# EAGLE design Bond-C3-Mini-VL-ALS (EAGLE 9.6.2)
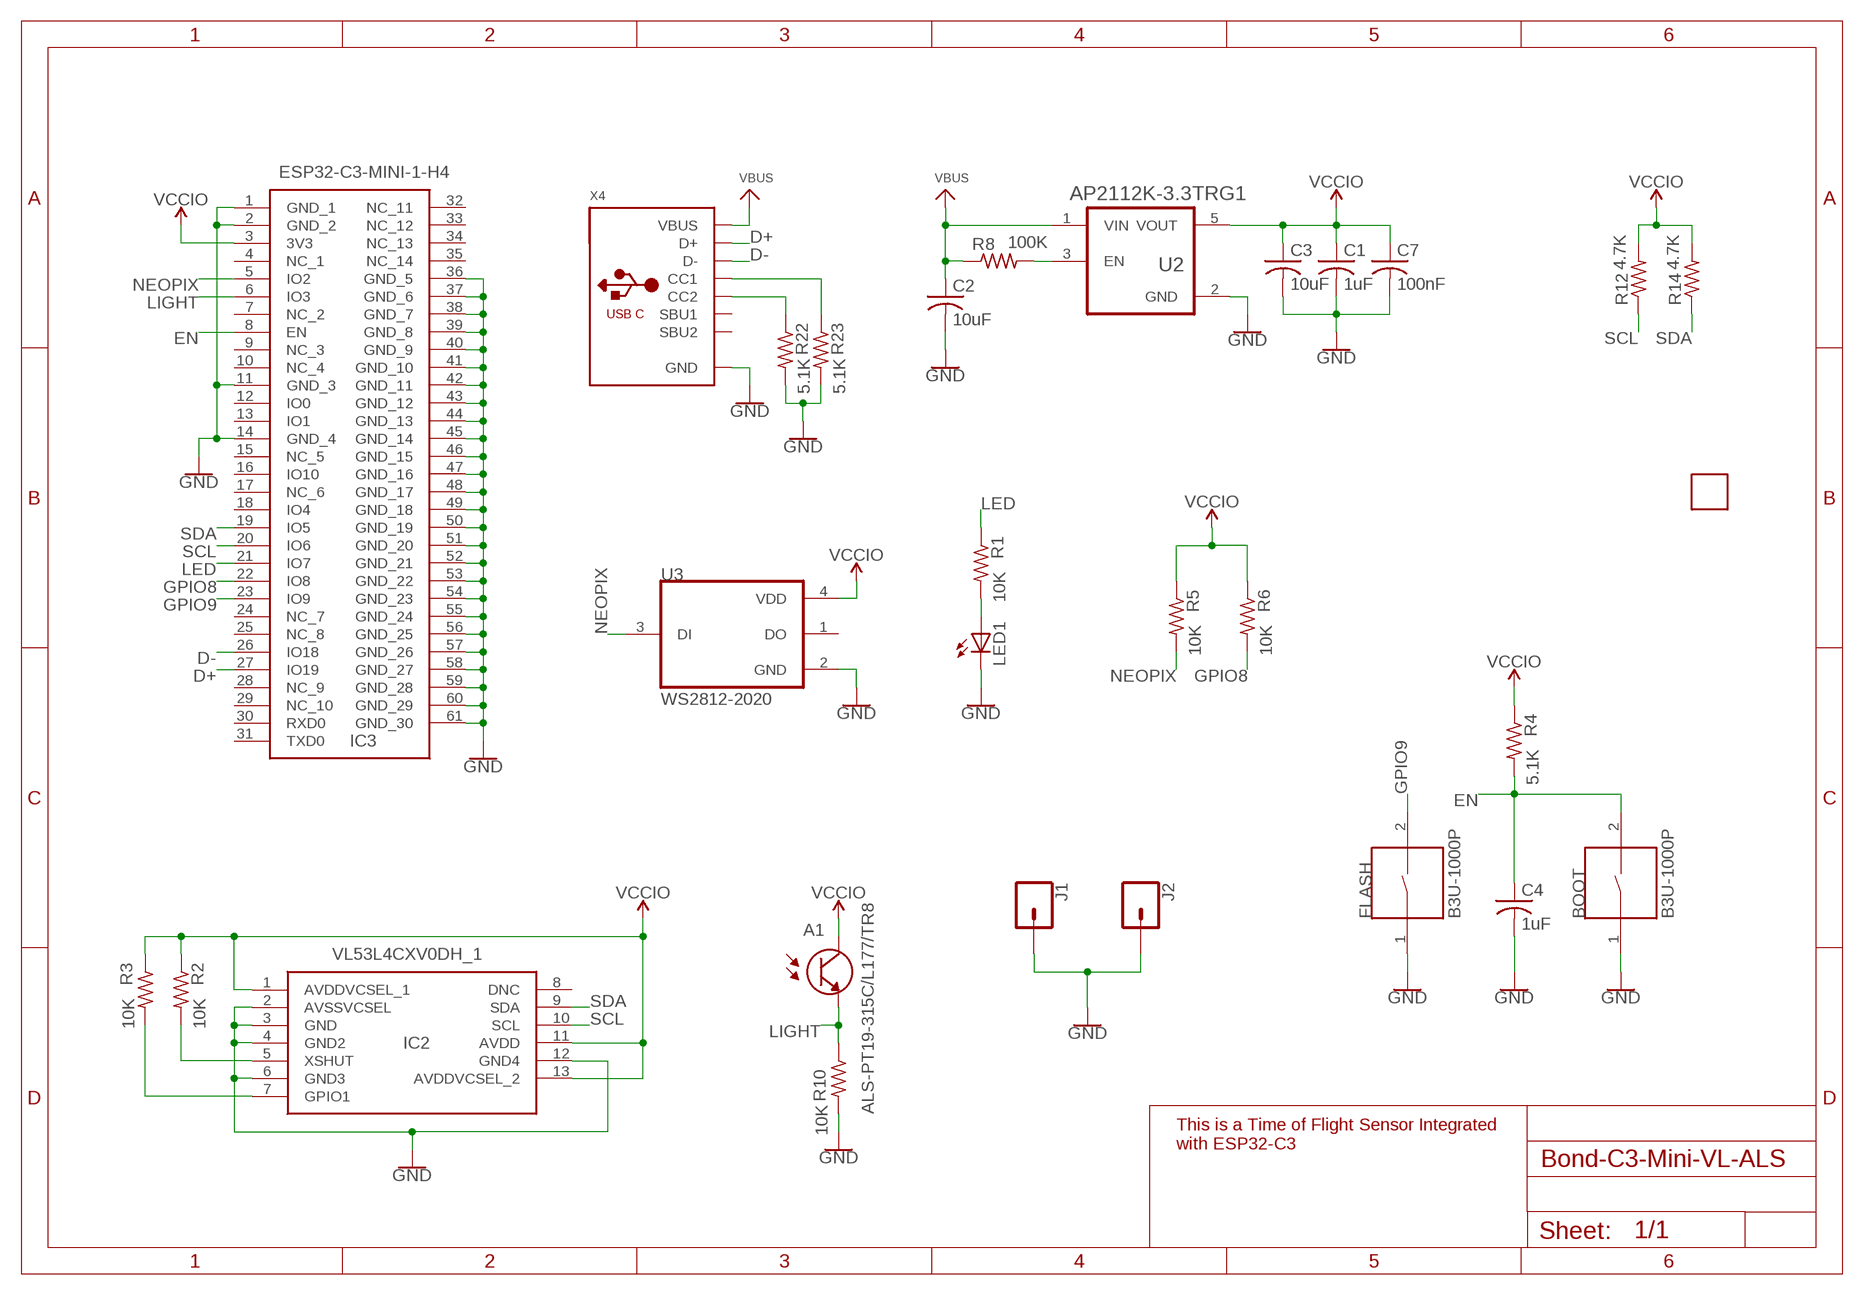
[diagram p0: schematic, sheet 1]

## Parts
A1  ALS-PT19-315C/L177/TR8  [XDCR_ALS-PT19-315C/L177/TR8]
BOOT  B3U-1000P  [SW_B3U-1000P]
C1  1uF  C-USC0402  [C0402]
C2  10uF  C-USC0402  [C0402]
C3  10uF  C-USC0402  [C0402]
C4  1uF  C-USC0402  [C0402]
C7  100nF  C-USC0402  [C0402]
FLASH  B3U-1000P  [SW_B3U-1000P]
IC2  VL53L4CXV0DH_1  [VL53L4CXV0DH1]
IC3  ESP32-C3-MINI-1-H4  [ESP32C3MINI1H4]
J1  CONN_01PTH_2MM  [1X01_2MM]
J2  CONN_01PTH_2MM  [1X01_2MM]
LED1  LEDCHIP-LED0603  [CHIP-LED0603]
R1  10K  R-US_R0402  [R0402]
R2  10K  R-US_R0402  [R0402]
R3  10K  R-US_R0402  [R0402]
R4  5.1K  R-US_R0402  [R0402]
R5  10K  R-US_R0402  [R0402]
R6  10K  R-US_R0402  [R0402]
R8  100K  R-US_R0402  [R0402]
R10  10K  R-US_R0402  [R0402]
R12  4.7K  R-US_R0402  [R0402]
R14  4.7K  R-US_R0402  [R0402]
R22  5.1K  R-US_R0402  [R0402]
R23  5.1K  R-US_R0402  [R0402]
U2  AP2112K-3.3TRG1  [SOT95P285X140-5N]
U3  WS2812-2020  [LED_WS2812-2020]
U$1  SMARTT_SMALL  [SMARTT_SMALL]
X4  MICROBUILDER_USB_C  [MICROBUILDER_USB_C_CUSB31-CFM2AX-01-X]

## Nets
D+: IC3.27(IO19) X4.A6(D+) X4.B6(D+)
D-: IC3.26(IO18) X4.A7(D-) X4.B7(D-)
EN: BOOT.2 C4.1 IC3.8(EN) R4.2
GND: BOOT.1 C1.2 C2.2 C3.2 C4.2 C7.2 FLASH.1 IC2.2(AVSSVCSEL) IC2.3(GND) IC2.4(GND2) IC2.6(GND3) IC2.12(GND4) IC3.1(GND_1) IC3.2(GND_2) IC3.11(GND_3) IC3.14(GND_4) IC3.36(GND_5) IC3.37(GND_6) IC3.38(GND_7) IC3.39(GND_8) IC3.40(GND_9) IC3.41(GND_10) IC3.42(GND_11) IC3.43(GND_12) IC3.44(GND_13) IC3.45(GND_14) IC3.46(GND_15) IC3.47(GND_16) IC3.48(GND_17) IC3.49(GND_18) IC3.50(GND_19) IC3.51(GND_20) IC3.52(GND_21) IC3.53(GND_22) IC3.54(GND_23) IC3.55(GND_24) IC3.56(GND_25) IC3.57(GND_26) IC3.58(GND_27) IC3.59(GND_28) IC3.60(GND_29) IC3.61(GND_30) J1.1 J2.1 LED1.C R10.2 R22.2 R23.2 U2.2(GND) U3.2(GND) X4.A1B12(GND) X4.B1A12(GND)
GPIO8: IC3.22(IO8) R6.2
GPIO9: FLASH.2 IC3.23(IO9)
LED: IC3.21(IO7) R1.1
LIGHT: A1.2(E) IC3.6(IO3) R10.1
N$1: IC2.7(GPIO1) R3.2
N$2: IC2.5(XSHUT) R2.2
N$3: LED1.A R1.2
N$7: R22.1 X4.B5(CC2)
N$9: R23.1 X4.A5(CC1)
N$23: R8.2 U2.3(EN)
NEOPIX: IC3.5(IO2) R5.2 U3.3(DI)
SCL: IC2.10(SCL) IC3.20(IO6) R12.1
SDA: IC2.9(SDA) IC3.19(IO5) R14.1
VBUS: C2.1 R8.1 U2.1(VIN) X4.A4B9(VBUS) X4.B4A9(VBUS)
VCCIO: A1.1(C) C1.1 C3.1 C7.1 IC2.1(AVDDVCSEL_1) IC2.11(AVDD) IC2.13(AVDDVCSEL_2) IC3.3(3V3) R2.1 R3.1 R4.1 R5.1 R6.1 R12.2 R14.2 U2.5(VOUT) U3.4(VDD)
Unconnected: IC2.8(DNC) IC3.4(NC_1) IC3.7(NC_2) IC3.9(NC_3) IC3.10(NC_4) IC3.12(IO0) IC3.13(IO1) IC3.15(NC_5) IC3.16(IO10) IC3.17(NC_6) IC3.18(IO4) IC3.24(NC_7) IC3.25(NC_8) IC3.28(NC_9) IC3.29(NC_10) IC3.30(RXD0) IC3.31(TXD0) IC3.32(NC_11) IC3.33(NC_12) IC3.34(NC_13) IC3.35(NC_14) U3.1(DO) X4.A8(SBU1) X4.B8(SBU2)

## Notes on the sheet
- This is a Time of Flight Sensor Integrated 
  with ESP32-C3

## Library data of the parts
A1 = ALS-PT19-315C_L177_TR8:ALS-PT19-315C/L177/TR8: Phototransistors 630nm 2-SMD, No Lead Check availability <https://pricing.snapeda.com/parts/ALS-PT19-315C/L177/TR8/Everlight/view-part?ref=eda>; AVAILABILITY: In Stock; DESCRIPTION: Phototransistors 630nm - 2-SMD, No Lead; MF: Everlight; MP: ALS-PT19-315C/L177/TR8; PACKAGE: SMD-2 Everlight; PRICE: None; PURCHASE-URL: https://pricing.snapeda.com/search/part/ALS-PT19-315C/L177/TR8/?ref=eda
BOOT FLASH = B3U-1000P:B3U-1000P: Switch Tactile N.O. SPST Round Button Gull Wing 0.05A 12VDC 1.5N SMD Embossed T/R; AVAILABILITY: Unavailable; DESCRIPTION: Switch Tactile N.O. SPST Round Button Gull Wing 0.05A 12VDC 1.5N SMD Embossed T/R; MF: Omron; MP: B3U-1000P; PACKAGE: None; PRICE: None
C1-C4 C7 = adafruit:C-US: CAPACITOR, American symbol
IC2 = VL53L4CXV0DH_1:VL53L4CXV0DH_1: Proximity Sensor Time of Flight(TOF) 600cm 2.6V to 3.5VDC 12-Pin LGA T/R Source: Datasheet <https://www.st.com/resource/en/datasheet/vl53l4cx.pdf>; DESCRIPTION: Proximity Sensor Time of Flight(TOF) 600cm 2.6V to 3.5VDC 12-Pin LGA T/R; HEIGHT: mm; MANUFACTURER_NAME: STMicroelectronics; MANUFACTURER_PART_NUMBER: VL53L4CXV0DH/1; MOUSER_PART_NUMBER: 511-VL53L4CXV0DH/1; MOUSER_PRICE-STOCK: https://www.mouser.co.uk/ProductDetail/STMicroelectronics/VL53L4CXV0DH-1?qs=QNEnbhJQKvb8OBPzwHQPmA%3D%3D
IC3 = ESP32-C3-MINI-1-H4:ESP32-C3-MINI-1-H4: SMD MODULE, ESP32-C3FH4, PCB ANT Source: Datasheet <https://www.mouser.es/datasheet/2/891/Espressif_ESP32_C3_MINI_1_Datasheet-2006822.pdf>; DESCRIPTION: SMD MODULE, ESP32-C3FH4, PCB ANT; HEIGHT: 2.55mm; MANUFACTURER_NAME: Espressif Systems; MANUFACTURER_PART_NUMBER: ESP32-C3-MINI-1-H4; MOUSER_PART_NUMBER: 356-ESP32-C3-MINI1H4; MOUSER_PRICE-STOCK: https://www.mouser.co.uk/ProductDetail/Espressif-Systems/ESP32-C3-MINI-1-H4?qs=stqOd1AaK78JkwNX13Q9hQ%3D%3D
J1 J2 = SparkFun-Connectors:CONN_01: Single connection point. Often used as Generic Header-pin footprint for 0.1 inch spaced/style header connections On any of the 0.1 inch spaced packages, you can populate with these: Break Away Headers - Straight <https://www.sparkfun.com/products/116> (PRT-00116) Break Away Male Headers - Right Angle <https://www.sparkfun.com/products/553> (PRT-00553) Female Headers <https://www.sparkfun.com/products/115> (PRT-00115) Break Away Headers - Machine Pin <https://www.sparkfun.com/products/117> (PRT-00117) Break Away Female Headers - Swiss Machine Pin <https://www.sparkfun.com/products/743> (PRT-00743) This device is also useful as a general connection point to wire up your design to another part of your project. Our various solder wires solder well into these plated through hole pads. Hook-Up Wire - Assortment (Stranded, 22 AWG) <https://www.sparkfun.com/products/11375> (PRT-11375) Hook-Up Wire - Assortment (Solid Core, 22 AWG) <https://www.sparkfun.com/products/11367> (PRT-11367) View the entire wire category on our website here <https://www.sparkfun.com/categories/141> Special notes: SMTSO-256-ET is a "flush mount" nut for a 4-40 screw. We mostly use this on specialty testbeds; it is a nice way to connect hardware to your PCB at an adjustable hieght. Also note, the SNAP packages are for using a snappable style connector. We sell a baggie of snaps and they are also used on two LilyPad designs: Snap Assortment - 30 pack (male and female) <https://www.sparkfun.com/products/11347> (DEV-11347) LilyPad Arduino SimpleSnap <https://www.sparkfun.com/products/10941> (DEV-10941) LilyPad SimpleSnap Protoboard <https://www.sparkfun.com/products/10940> (DEV-10940)
LED1 = adafruit:LED: LED OSRAM: - CHIPLED LG R971, LG N971, LY N971, LG Q971, LY Q971, LO R971, LY R971 LH N974, LH R974 LS Q976, LO Q976, LY Q976 LO Q996 - Hyper CHIPLED LW Q18S LB Q993, LB Q99A, LB R99A - SideLED LS A670, LO A670, LY A670, LG A670, LP A670 LB A673, LV A673, LT A673, LW A673 LH A674 LY A675 LS A676, LA A676, LO A676, LY A676, LW A676 LS A679, LY A679, LG A679 - Hyper Micro SIDELED® LS Y876, LA Y876, LO Y876, LY Y876 LT Y87S - SmartLED LW L88C, LW L88S LB L89C, LB L89S, LG L890 LS L89K, LO L89K, LY L89K LS L896, LA L896, LO L896, LY L896 - TOPLED LS T670, LO T670, LY T670, LG T670, LP T670 LSG T670, LSP T670, LSY T670, LOP T670, LYG T670 LG T671, LOG T671, LSG T671 LB T673, LV T673, LT T673, LW T673 LH T674 LS T676, LA T676, LO T676, LY T676, LB T676, LH T676, LSB T676, LW T676 LB T67C, LV T67C, LT T67C, LS T67K, LO T67K, LY T67K, LW E67C LS E67B, LA E67B, LO E67B, LY E67B, LB E67C, LV E67C, LT E67C LW T67C LS T679, LY T679, LG T679 LS T770, LO T770, LY T770, LG T770, LP T770 LB T773, LV T773, LT T773, LW T773 LH T774 LS E675, LA E675, LY E675, LS T675 LS T776, LA T776, LO T776, LY T776, LB T776 LHGB T686 LT T68C, LB T68C - Hyper Mini TOPLED® LB M676 - Mini TOPLED Santana® LG M470 LS M47K, LO M47K, LY M47K Source: http://www.osram.convergy.de/
R1-R6 R8 R10 R12 R14 R22 R23 = adafruit:R-US_: RESISTOR, American symbol
U2 = AP2112K-3.3TRG1:AP2112K-3.3TRG1: AP2112 Series 0.6 A 3.3 V Fixed Output SMT LDO Linear Regulator - SOT23-5; AVAILABILITY: Unavailable; DESCRIPTION: AP2112 Series 0.6 A 3.3 V Fixed Output SMT LDO Linear Regulator - SOT23-5; MF: Diodes Inc.; MP: AP2112K-3.3TRG1; PACKAGE: SOT-753 Diodes Inc.; PRICE: None
U3 = WS2812-2020:WS2812-2020: Intelligent control LED integrated light source Check availability <https://pricing.snapeda.com/parts/WS2812-2020/Worldsemi/view-part?ref=eda>; AVAILABILITY: Not in stock; DESCRIPTION: Intelligent control LED light source, SMD-4; MF: Worldsemi; MP: WS2812-2020; PACKAGE: Package; PRICE: None
U$1 = Bitmaps:SMARTT_SMALL
X4 = Adafruit Feather STM32F405 Express:MICROBUILDER_USB_C: USB Type-C USB 2.0 Connector

## Board
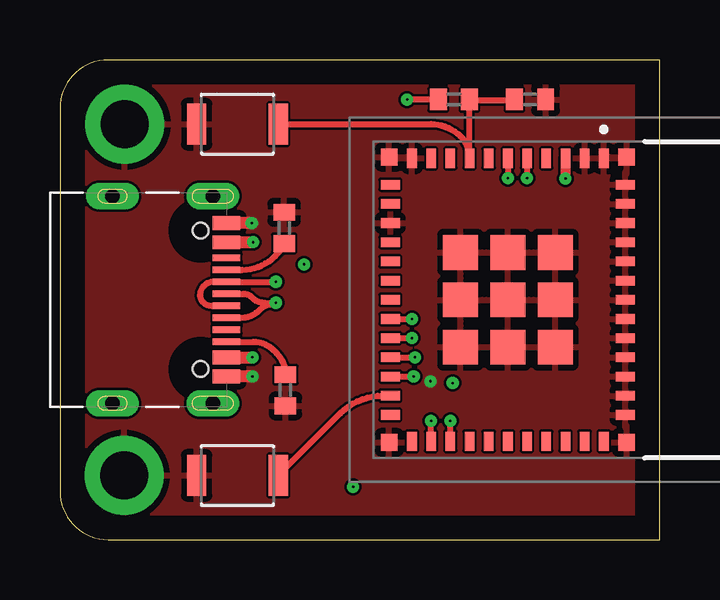
[diagram p1: board, top side]
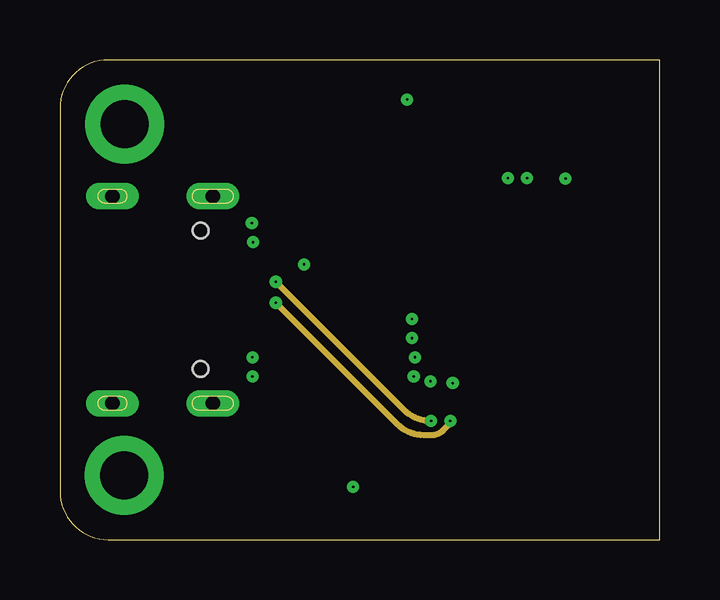
[diagram p2: board, inner layer Route2]
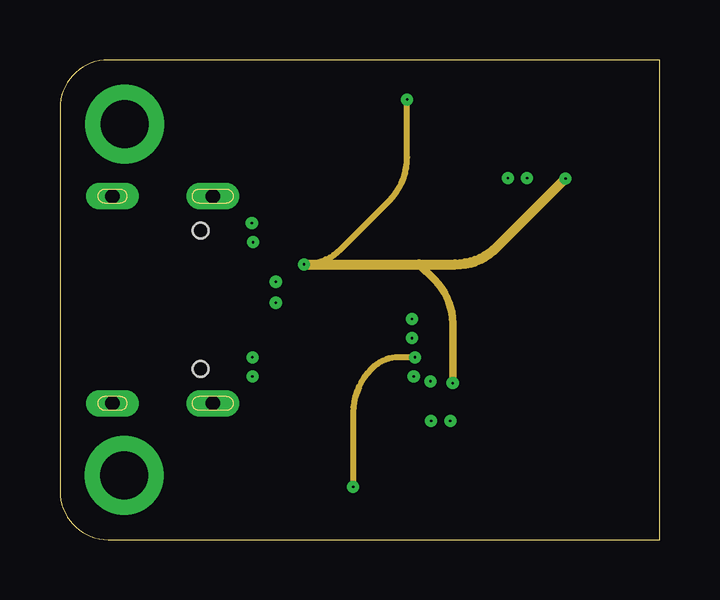
[diagram p3: board, inner layer Route15]
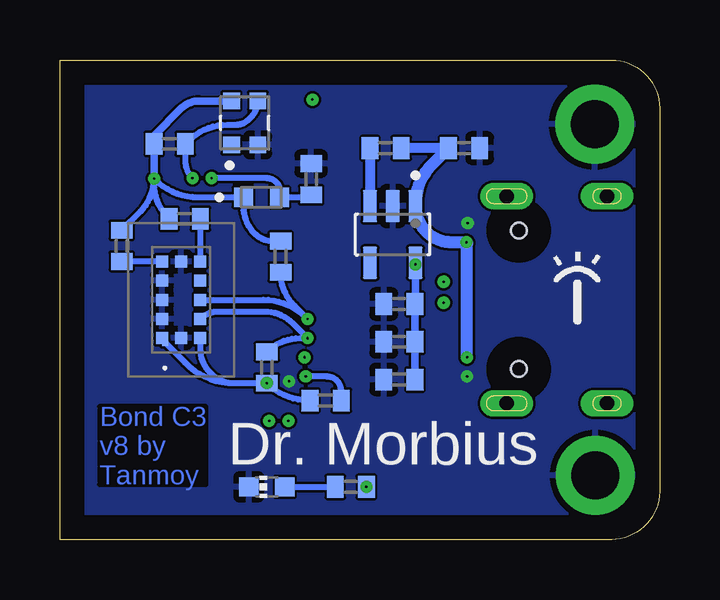
[diagram p4: board, bottom side, seen from below]

Size 25 x 20 mm. Coordinates in mm from the lower left corner, seen from the top.
Outline: 2,0 25,0 25,20 2,20 arc90 0,18 0,2 arc90 2,0
Copper layers (1+2*15+16): Top 0.035mm / dielectric 1.11mm / Route2 0.035mm / dielectric 0.15mm / Route15 0.035mm / dielectric 0.2mm / Bottom 0.035mm
Design rules "default *": minimum track width 4mil, minimum drill 0.2mm, track to track 4mil, track to pad 4mil, pad to pad 4mil, via to via 4mil, smd to smd 4mil, copper to edge 40mil, drill to drill 4mil, minimum pad ring 10mil, minimum via ring 8mil, stop-mask expansion 4mil, vias tented up to drill 0mil, thermal gap 10mil

### Footprints (pad centres in the part's own frame; a part is rotated, then mirrored left to right if it is on the bottom)
XDCR_ALS-PT19-315C/L177/TR8 = smd 0.8 x 0.8: 1 -0.75,0; 2 0.75,0
SW_B3U-1000P = smd 0.8 x 1.7: 1 -1.7,0; 2 1.7,0
C0402 = smd 0.7 x 0.9: 1 -0.65,0; 2 0.65,0
VL53L4CXV0DH1 = smd 0.58 x 0.25: 1 1.64,-0.675 | smd 0.5 x 0.5: 2 0.8,-0.8; 3 0,-0.8; 4 -0.8,-0.8; 5 -1.6,-0.8; 6 -1.6,0; 7 -1.6,0.8; 8 -0.8,0.8; 9 0,0.8; 10 0.8,0.8; 11 1.6,0.8; 12 1.6,0 | smd 0.5 x 0.25: 13 1.6,-0.925
ESP32C3MINI1H4 = smd 0.8 x 0.4: 1 -5.9,4; 2 -5.9,3.2; 3 -5.9,2.4; 4 -5.9,1.6; 5 -5.9,0.8; 6 -5.9,0; 7 -5.9,-0.8; 8 -5.9,-1.6; 9 -5.9,-2.4; 10 -5.9,-3.2; 11 -5.9,-4; 25 5.9,-4; 26 5.9,-3.2; 27 5.9,-2.4; 28 5.9,-1.6; 29 5.9,-0.8; 30 5.9,0; 31 5.9,0.8; 32 5.9,1.6; 33 5.9,2.4; 34 5.9,3.2; 35 5.9,4 | smd 0.4 x 0.8: 12 -4.8,-4.9; 13 -4,-4.9; 14 -3.2,-4.9; 15 -2.4,-4.9; 16 -1.6,-4.9; 17 -0.8,-4.9; 18 0,-4.9; 19 0.8,-4.9; 20 1.6,-4.9; 21 2.4,-4.9; 22 3.2,-4.9; 23 4,-4.9; 24 4.8,-4.9; 36 4.8,4.9; 37 4,4.9; 38 3.2,4.9; 39 2.4,4.9; 40 1.6,4.9; 41 0.8,4.9; 42 0,4.9; 43 -0.8,4.9; 44 -1.6,4.9; 45 -2.4,4.9; 46 -3.2,4.9; 47 -4,4.9; 48 -4.8,4.9 | smd 1.45 x 1.45: 49 0,0; 50 1.975,1.975; 51 0,1.975; 52 -1.975,1.975; 53 -1.975,0; 54 -1.975,-1.975; 55 0,-1.975; 56 1.975,-1.975; 57 1.975,0 | smd 0.7 x 0.7: 58 -5.95,4.95; 59 -5.95,-4.95; 60 5.95,-4.95; 61 5.95,4.95
1X01_2MM = drill 2 pad 3.302: 1 0,0
CHIP-LED0603 = smd 0.8 x 0.8: A 0,-0.75; C 0,0.75
R0402 = smd 0.7 x 0.9: 1 -0.65,0; 2 0.65,0
SOT95P285X140-5N = smd 1.35 x 0.6: 1 -1.185,0.95; 2 -1.185,0; 3 -1.185,-0.95; 4 1.185,-0.95; 5 1.185,0.95
LED_WS2812-2020 = smd 0.7 x 0.7: 1 -0.915,0.55; 2 -0.915,-0.55; 3 0.915,-0.55; 4 0.915,0.55
MICROBUILDER_USB_C_CUSB31-CFM2AX-01-X = smd 0.575 x 1.15: A1B12 -3.2,3.545; A4B9 -2.4,3.545; B1A12 3.2,3.545; B4A9 2.4,3.545 | smd 0.275 x 1.15: A5 -1.25,3.545; A6 -0.25,3.545; A7 0.25,3.545; A8 1.25,3.545; B5 1.75,3.545; B6 0.75,3.545; B7 -0.75,3.545; B8 -1.75,3.545 | drill 0.6 pad 1 long: M1 -4.32,2.97; M2 4.32,2.97; M3 -4.32,-1.21; M4 4.32,-1.21 | hole 0.65: 2.89,2.47; -2.89,2.47

### Placement (x,y rotation side)
A1  16.6,14.28 0 bottom
BOOT  7.4,17.32 0 top
C1  10.85,9.82 180 bottom
C2  8.15,16.32 0 bottom
C3  10.85,8.25 180 bottom
C4  19.6,18.35 0 top
C7  10.85,6.67 180 bottom
FLASH  7.4,2.67 0 top
IC2  19.95,10 270 bottom
IC3  18.68,10 270 top
J1  2.7,17.32 0 top
J2  2.67,2.67 0 top
LED1  16.38,2.2 90 bottom
R1  12.88,2.2 180 bottom
R2  22.43,12.25 270 bottom
R3  19.8,13.38 0 bottom
R4  16.43,18.35 0 top
R5  20.43,16.5 0 bottom
R6  13.93,5.8 0 bottom
R8  11.43,16.32 180 bottom
R10  14.53,15.03 90 bottom
R12  16.38,7.17 270 bottom
R14  15.8,11.8 90 bottom
R22  9.4,6.22 270 top
R23  9.35,13 90 top
U2  11.12,12.72 270 bottom
U3  17.3,17.38 90 bottom
U$1  2.15,8.85 0 top
X4  3.4,10 270 top

### Tracks (layer width: path | path; a pad name or v marks a point on that pad's centre or on a via)
D+  (via drill 0.1)
  Top 0.254: X4.B6 7.54,9.25 arc45 8.32,9.57 arc-45 8.96,9.84 v9,9.88 8.54,9.88 arc-45 8,10.1 arc45 7.64,10.25 X4.A6 | IC3.27 v16.27,4.95
  Route2 0.254: v9,9.88 14.07,4.8 arc45 15.17,4.35 15.49,4.35 arc45 15.97,4.55 16.2,4.78 arc45 v16.27,4.95
D-  (via drill 0.1)
  Top 0.254: v9,10.75 X4.B7 6.42,10.75 arc45 6,10.57 arc45 5.84,10.19 arc45 5.96,9.9 arc45 6.33,9.75 X4.A7 | IC3.26 v15.47,4.95
  Route2 0.254: v9,10.75 14.32,5.43 arc45 v15.47,4.95
EN
  Top 0.254: 17.07,18.3 IC3.8 arc45 16.7,16.82 arc45 15.47,17.32 BOOT.2 | 17.07,18.3 R4.2 | C4.1 arc-45 18.83,18.3 17.07,18.3
GND  (via drill 0.1)
  Top 0.406: R23.2 arc-45 9.53,13.72
  Top 0.508: v8,13.2 X4.A1B12 | v8.03,6.8 X4.B1A12
  other vias: 15.45,6.6
  pour Top: 24.75,0.25 2.25,0.25 arc-90 0.25,2.25 0.25,17.75 arc-90 2.25,19.75 24.75,19.75
  pour Bottom: 24.75,0.25 2.25,0.25 arc-90 0.25,2.25 0.25,17.75 arc-90 2.25,19.75 24.75,19.75
GPIO8  (via drill 0.1)
  Top 0.254: IC3.22 v14.75,6.8
  Bottom 0.254: R6.2 13.28,6.2 arc-45 13.45,6.62 arc-45 13.87,6.8 v14.75,6.8
GPIO9
  Top 0.254: FLASH.2 11.68,5.26 arc-45 13.48,6 IC3.23
LED  (via drill 0.1)
  Top 0.254: IC3.21 v14.8,7.6
  Route15 0.254: v14.8,7.6 14.11,7.6 arc45 13.03,7.15 12.97,7.09 arc45 12.22,5.3 R1.1
  other vias: 12.22,2.2
LIGHT  (via drill 0.1)
  Top 0.254: IC3.6 v18.68,15.07
  Bottom 0.254: R10.1 arc45 14.77,14.28 A1.2 15.85,14.63 arc-45 15.95,14.88 arc-45 16.43,15.07 v18.68,15.07
N$1
  Bottom 0.254: R3.2 IC2.7
N$2
  Bottom 0.254: IC2.5 R2.2
N$3
  Bottom 0.254: LED1.A R1.2
N$7
  Top 0.254: X4.B5 8.05,8.25 arc-45 8.9,7.9 9.03,7.77 arc-45 R22.1
N$9
  Top 0.254: X4.A5 7.59,11.25 arc45 8.97,11.82
  Top 0.27: 8.97,11.82 9.35,12.2 arc-45 R23.1
N$23
  Bottom 0.406: R8.2 U2.3
NEOPIX  (via drill 0.1)
  Top 0.254: IC3.5 v19.48,15.07
  Bottom 0.254: v19.48,15.07 arc45 19.77,15.8 R5.2 19.65,16.63 arc45 18.02,17.3 17.67,17.3 arc-45 17.12,17.52 17.03,17.62 arc-45 U3.3
SCL  (via drill 0.1)
  Top 0.254: IC3.20 v14.68,8.4
  Bottom 0.254: R12.1 arc45 14.99,8.4 v14.68,8.4 15.28,9 arc-45 16.48,9.5 18.43,9.5 arc-45 IC2.10
SDA  (via drill 0.1)
  Top 0.254: IC3.19 v14.68,9.2
  Bottom 0.254: IC2.9 16.53,10 arc45 14.73,9.26 v14.68,9.2 15.22,9.74 arc45 R14.1
VBUS  (via drill 0.1)
  Top 0.508: X4.B4A9 v8.03,7.6 | X4.A4B9 v8.05,12.4
  Bottom 0.406: C2.1 R8.1
  Bottom 0.508: v8.03,7.6 8.03,12.34 arc-45 v8.05,12.4 8.66,12.4 arc90 U2.1 10.18,14.02 arc45 9.52,15.61 C2.1
VCCIO  (via drill 0.1)
  Top 0.254: R4.1 v14.47,18.35
  Top 0.406: IC3.3 v21.07,15.05
  Route15 0.254: v10.18,11.47 arc45 11.71,12.11 13.73,14.13 arc45 14.47,15.93 v14.47,18.35
  Route15 0.305: v16.38,6.53 16.38,9.02 arc45 15.63,10.82 14.97,11.47
  Route15 0.406: v10.18,11.47 14.97,11.47 16.47,11.47 arc45 18.23,12.2 v21.07,15.05
  Bottom 0.254: IC2.1 arc-45 20.72,8.4 | U2.5 v10.18,11.47 | IC2.13 20.72,8.4 | 20.72,8.4 arc45 IC2.1 | IC2.1 20.62,8.21 19.79,7.38 arc-45 17.74,6.53 | 17.74,6.53 v16.38,6.53 arc-45 14.62,5.8 R6.1 | R2.1 21.64,13.68 arc-45 v21.07,15.05 | R3.1 arc45 21.07,14.88 v21.07,15.05 | v21.07,15.05 21.04,15.02 arc-45 19.25,14.28 A1.1 17.35,13.86 arc-45 16.9,12.78 arc-45 16.11,12.45 R14.2 | IC2.11 19.15,7.92 arc-45 18.76,6.99 18.7,6.92 arc-45 17.74,6.53
  Bottom 0.305: U2.5 10.18,9.88 arc45 C1.1 C3.1 C7.1 | v21.07,15.05 R5.1 21.07,16.85 19.94,17.99 arc45 19.21,18.29 U3.4

### Text on the board
Bottom: Bond C3 / v8 by / Tanmoy
bNames: Dr. Morbius